# Altium schematic sheet Sheet3.SchDoc
size A
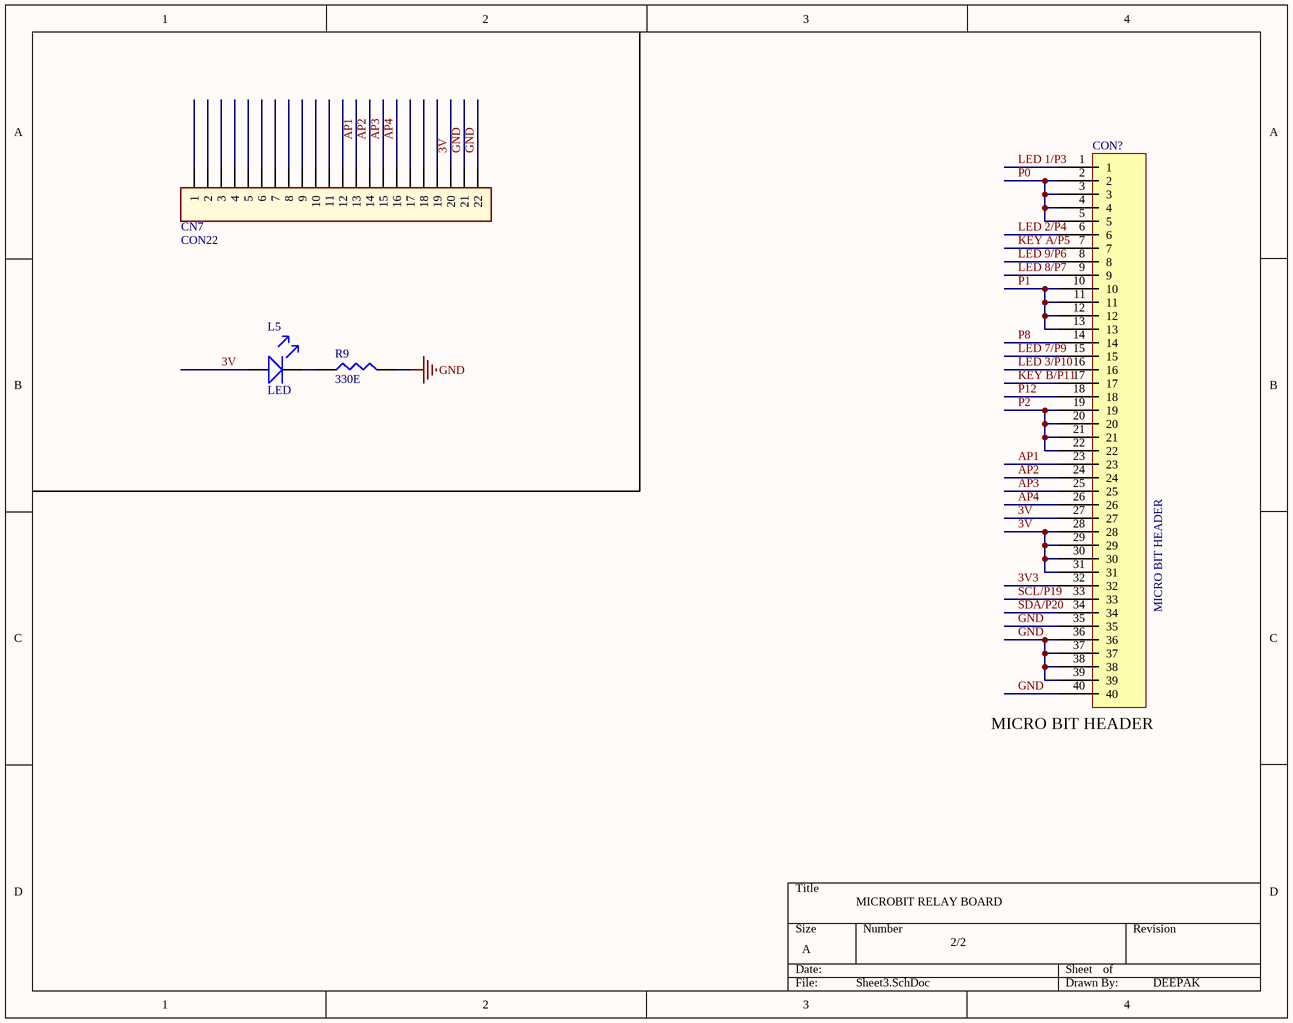
[diagram p0: Sheet3.SchDoc]

## Parts
CN7  CON22  [CON22  berg]
CON?  MICRO BIT HEADER  [MICROBIT HEADER STRAIGHT]
L5  LED  [0805 _LED]
R9  330E  [0603]

## Nets
GND: CN7.21 CN7.22 CON?.35 CON?.36 CON?.37 CON?.38 CON?.39 CON?.40 R9.2
3V: CN7.20 CON?.27 CON?.28 CON?.29 CON?.30 CON?.31 L5.A
3V3: CON?.32
AP1: CN7.13 CON?.23
AP2: CN7.14 CON?.24
AP3: CN7.15 CON?.25
AP4: CN7.16 CON?.26
KEY A/P5: CON?.7
KEY B/P11: CON?.17
LED 1/P3: CON?.1
LED 2/P4: CON?.6
LED 3/P10: CON?.16
LED 7/P9: CON?.15
LED 8/P7: CON?.9
LED 9/P6: CON?.8
P0: CON?.2 CON?.3 CON?.4 CON?.5
P1: CON?.10 CON?.11 CON?.12 CON?.13
P2: CON?.19 CON?.20 CON?.21 CON?.22
P8: CON?.14
P12: CON?.18
SCL/P19: CON?.33
SDA/P20: CON?.34
NetL5_K: L5.K R9.1

Not connected (* = marked no-connect by the designer): CN7 1 2 3 4 5 6 7 8 9 10 11 12 17 18 19

## Notes on the sheet
- (near CON?) MICRO BIT HEADER
- MICROBIT RELAY BOARD
- 2/2
- DEEPAK

## Library data of the parts
CON? = MICRO BIT HEADER 40 PIN
R9 = RES